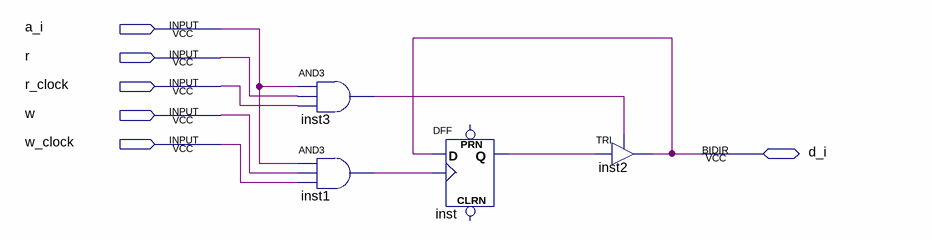
[diagram p0: schematic sheet]
// Quartus schematic ram_i.bdf as structural Verilog: 4 symbols, 6 pins
module ram_i (
  input  a_i,
  input  r,
  input  r_clock,
  input  w,
  input  w_clock,
  inout  d_i
);

  wire inst1_out, inst3_out, inst_q;

  and inst3 (inst3_out, a_i, r, r_clock);
  and inst1 (inst1_out, a_i, w, w_clock);
  DFF inst (.CLK(inst1_out), .D(d_i), .Q(inst_q));  // open: CLRN, PRN
  TRI inst2 (.IN(inst_q), .OE(inst3_out), .OUT(d_i));
endmodule
